# EAGLE design ChordControllerMain (EAGLE 5.10)

## Sheet 1 of 2
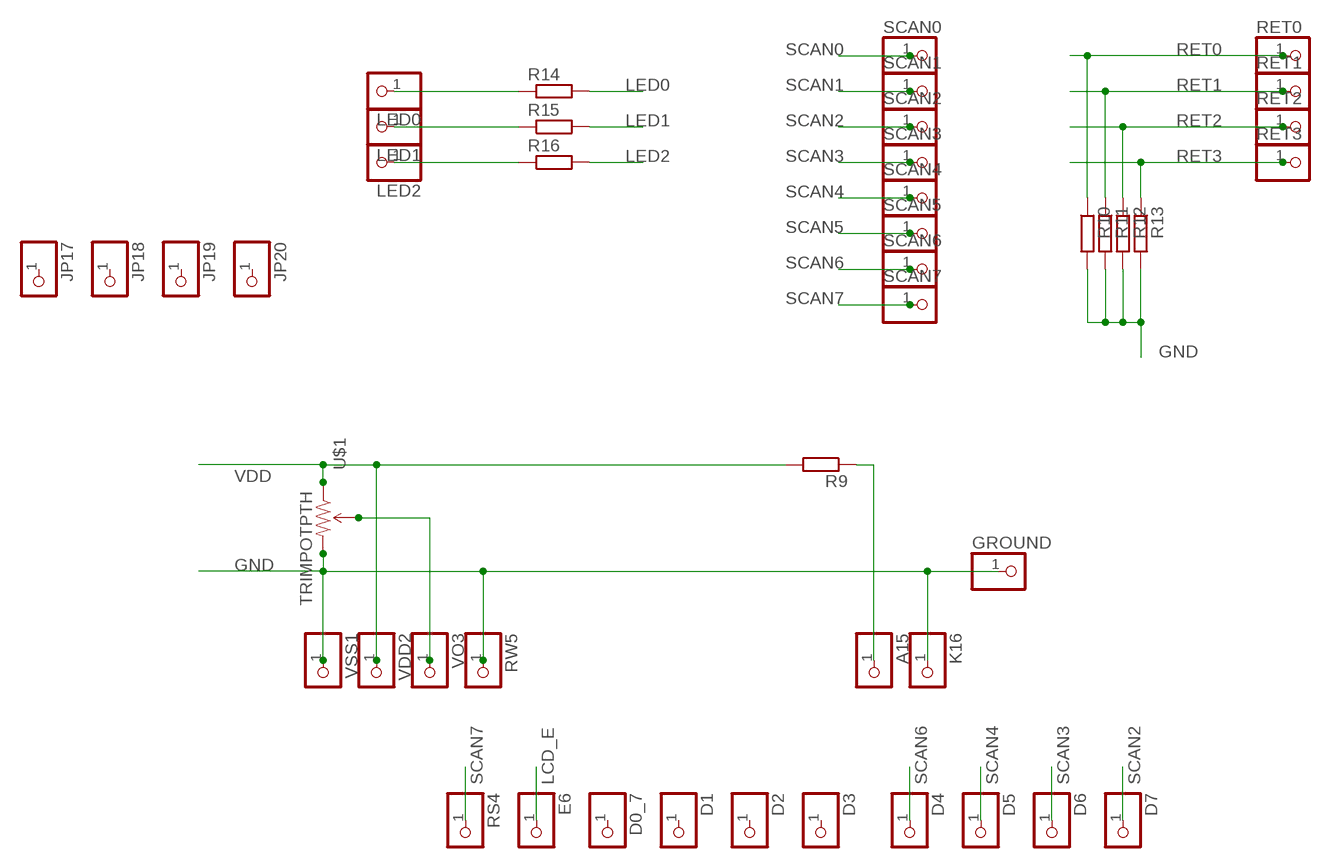
[diagram p0: schematic, sheet 1]

### Parts
A15  PINHD-1X1  [1X01]
D0_7  PINHD-1X1  [1X01]
D1  PINHD-1X1  [1X01]
D2  PINHD-1X1  [1X01]
D3  PINHD-1X1  [1X01]
D4  PINHD-1X1  [1X01]
D5  PINHD-1X1  [1X01]
D6  PINHD-1X1  [1X01]
D7  PINHD-1X1  [1X01]
E6  PINHD-1X1  [1X01]
GROUND  PINHD-1X1  [1X01]
JP17  PINHD-1X1  [1X01]
JP18  PINHD-1X1  [1X01]
JP19  PINHD-1X1  [1X01]
JP20  PINHD-1X1  [1X01]
K16  PINHD-1X1  [1X01]
LED0  PINHD-1X1  [1X01]
LED1  PINHD-1X1  [1X01]
LED2  PINHD-1X1  [1X01]
R9  R-EU_0204/7  [0204/7]
R10  R-EU_0204/7  [0204/7]
R11  R-EU_0204/7  [0204/7]
R12  R-EU_0204/7  [0204/7]
R13  R-EU_0204/7  [0204/7]
R14  R-EU_0204/7  [0204/7]
R15  R-EU_0204/7  [0204/7]
R16  R-EU_0204/7  [0204/7]
RET0  PINHD-1X1  [1X01]
RET1  PINHD-1X1  [1X01]
RET2  PINHD-1X1  [1X01]
RET3  PINHD-1X1  [1X01]
RS4  PINHD-1X1  [1X01]
RW5  PINHD-1X1  [1X01]
SCAN0  PINHD-1X1  [1X01]
SCAN1  PINHD-1X1  [1X01]
SCAN2  PINHD-1X1  [1X01]
SCAN3  PINHD-1X1  [1X01]
SCAN4  PINHD-1X1  [1X01]
SCAN5  PINHD-1X1  [1X01]
SCAN6  PINHD-1X1  [1X01]
SCAN7  PINHD-1X1  [1X01]
U$1  TRIMPOTPTH  [TRIM_POT_PTH]
VDD2  PINHD-1X1  [1X01]
VO3  PINHD-1X1  [1X01]
VSS1  PINHD-1X1  [1X01]

### Nets
GND: GROUND.1 K16.1 R10.2 R11.2 R12.2 R13.2 RW5.1 U$1.3(CW) VSS1.1 ; also sheet 2
LCD_E: E6.1 ; also sheet 2
LED0: R14.2 ; also sheet 2
LED1: R15.2 ; also sheet 2
LED2: R16.2 ; also sheet 2
N$20: LED0.1 R14.1
N$22: LED1.1 R15.1
N$23: U$1.2(WIPER) VO3.1
N$24: LED2.1 R16.1
N$31: A15.1 R9.1
RET0: R10.1 RET0.1 ; also sheet 2
RET1: R11.1 RET1.1 ; also sheet 2
RET2: R12.1 RET2.1 ; also sheet 2
RET3: R13.1 RET3.1 ; also sheet 2
SCAN0: SCAN0.1 ; also sheet 2
SCAN1: SCAN1.1 ; also sheet 2
SCAN2: D7.1 SCAN2.1 ; also sheet 2
SCAN3: D6.1 SCAN3.1 ; also sheet 2
SCAN4: D5.1 SCAN4.1 ; also sheet 2
SCAN5: SCAN5.1 ; also sheet 2
SCAN6: D4.1 SCAN6.1 ; also sheet 2
SCAN7: RS4.1 SCAN7.1 ; also sheet 2
VDD: R9.2 U$1.1(CCW) VDD2.1 ; also sheet 2
Unconnected: D0_7.1 D1.1 D2.1 D3.1 JP17.1 JP18.1 JP19.1 JP20.1

## Sheet 2 of 2
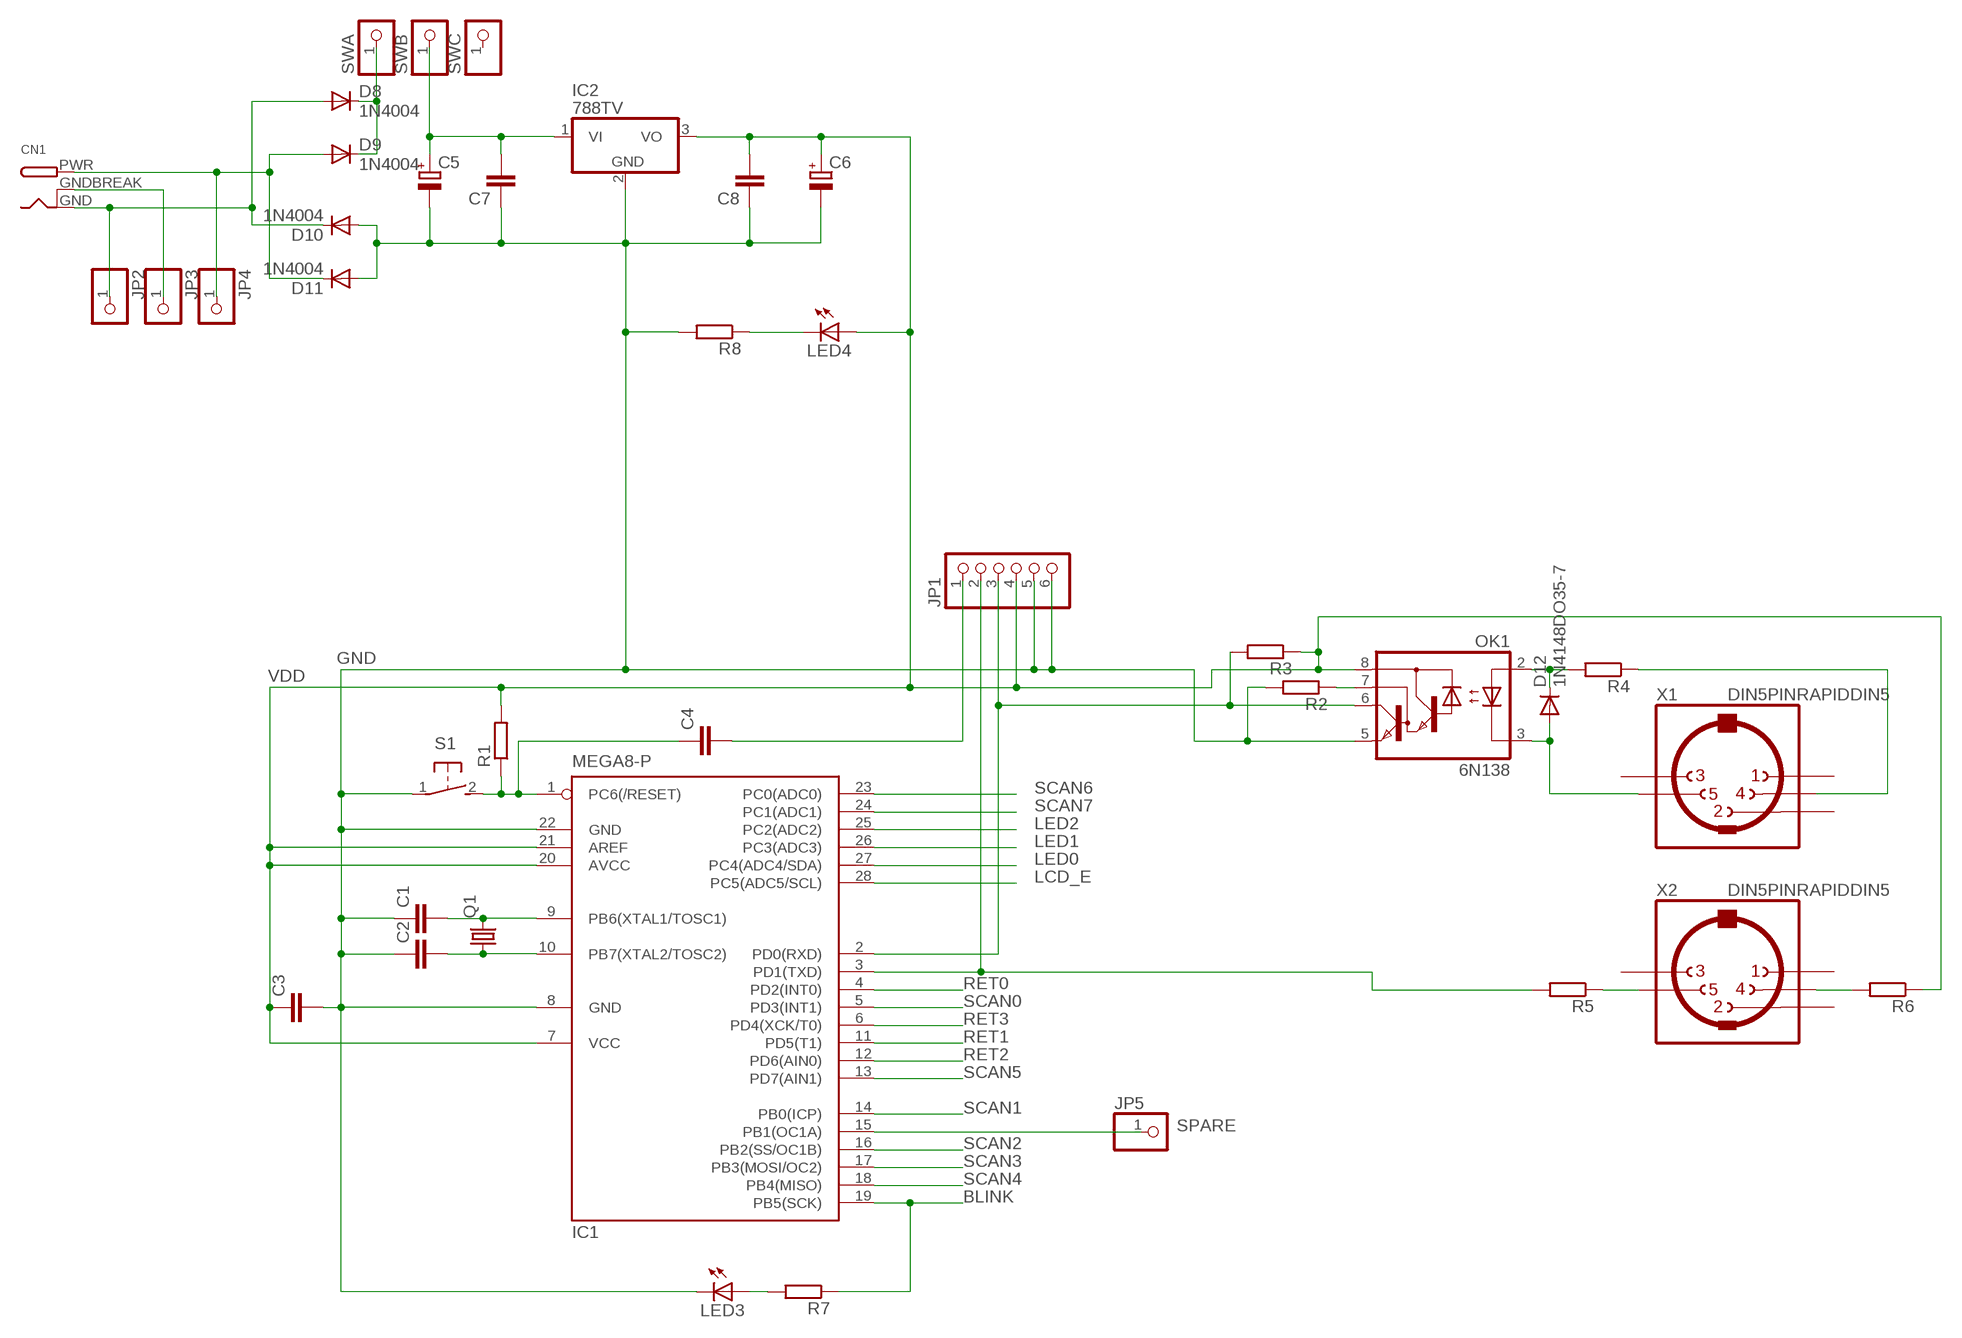
[diagram p1: schematic, sheet 2]

### Parts
C1  C-EU025-025X050  [C025-025X050]
C2  C-EU025-025X050  [C025-025X050]
C3  C-EU025-025X050  [C025-025X050]
C4  C-EU025-025X050  [C025-025X050]
C5  CPOL-EUE2.5-6  [E2,5-6]
C6  CPOL-EUE2.5-6  [E2,5-6]
C7  C-EU025-025X050  [C025-025X050]
C8  C-EU025-025X050  [C025-025X050]
CN1  DCBARRELPTH  [DCJACK_2MM_PTH]
D8  1N4004  [DO41-10]
D9  1N4004  [DO41-10]
D10  1N4004  [DO41-10]
D11  1N4004  [DO41-10]
D12  1N4148DO35-7  [DO35-7]
IC1  MEGA8-P  [DIL28-3]
IC2  788TV  [TO220V]
JP1  PINHD-1X6  [1X06]
JP2  HEADER-1X1  [1X01_OVAL]
JP3  HEADER-1X1  [1X01_OVAL]
JP4  HEADER-1X1  [1X01_OVAL]
JP5  HEADER-1X1  [1X01_OVAL]
LED3  LED3MM  [LED3MM]
LED4  LED3MM  [LED3MM]
OK1  6N138  [DIL08]
Q1  CRYSTALHC49S  [HC49/S]
R1  R-EU_0204/7  [0204/7]
R2  R-EU_0204/7  [0204/7]
R3  R-EU_0204/7  [0204/7]
R4  R-EU_0204/7  [0204/7]
R5  R-EU_0204/7  [0204/7]
R6  R-EU_0204/7  [0204/7]
R7  R-EU_0204/7  [0204/7]
R8  R-EU_0204/7  [0204/7]
S1  31-XX  [B3F-31XX]
SWA  HEADER-1X1  [1X01_OVAL]
SWB  HEADER-1X1  [1X01_OVAL]
SWC  HEADER-1X1  [1X01_OVAL]
X1  DIN5PINRAPIDDIN5  [RAPIDDIN5]
X2  DIN5PINRAPIDDIN5  [RAPIDDIN5]

### Nets
BLINK: IC1.19(PB5(SCK)) R7.1
GND: C1.1 C2.1 C3.2 C5.- C6.- C7.1 C8.1 D10.A D11.A IC1.8(GND) IC1.22(GND) IC2.2(GND) JP1.5 JP1.6 LED3.K(C) OK1.5(GND) R2.2 R8.2 S1.1(P) ; also sheet 1
LCD_E: IC1.28(PC5(ADC5/SCL)) ; also sheet 1
LED0: IC1.27(PC4(ADC4/SDA)) ; also sheet 1
LED1: IC1.26(PC3(ADC3)) ; also sheet 1
LED2: IC1.25(PC2(ADC2)) ; also sheet 1
N$1: C1.2 IC1.9(PB6(XTAL1/TOSC1)) Q1.2
N$2: C2.2 IC1.10(PB7(XTAL2/TOSC2)) Q1.1
N$3: LED4.K(C) R8.1
N$4: D8.C D9.C SWA.1
N$5: C4.1 IC1.1(PC6(/RESET)) R1.1 S1.2(S)
N$6: C5.+ C7.2 IC2.1(VI) SWB.1
N$7: C4.2 JP1.1
N$9: IC1.3(PD1(TXD)) JP1.2 R5.2
N$10: IC1.2(PD0(RXD)) JP1.3 OK1.6(VO) R3.2
N$11: CN1.PWR D9.A D11.C JP4.1
N$12: CN1.GND D8.A D10.C JP2.1
N$13: CN1.GNDBREAK JP3.1
N$14: OK1.7(VB) R2.1
N$15: D12.C OK1.2(A) R4.2
N$16: D12.A OK1.3(C) X1.5
N$17: R4.1 X1.4
N$18: R5.1 X2.5
N$19: R6.2 X2.4
N$21: LED3.A R7.2
RET0: IC1.4(PD2(INT0)) ; also sheet 1
RET1: IC1.11(PD5(T1)) ; also sheet 1
RET2: IC1.12(PD6(AIN0)) ; also sheet 1
RET3: IC1.6(PD4(XCK/T0)) ; also sheet 1
SCAN0: IC1.5(PD3(INT1)) ; also sheet 1
SCAN1: IC1.14(PB0(ICP)) ; also sheet 1
SCAN2: IC1.16(PB2(SS/OC1B)) ; also sheet 1
SCAN3: IC1.17(PB3(MOSI/OC2)) ; also sheet 1
SCAN4: IC1.18(PB4(MISO)) ; also sheet 1
SCAN5: IC1.13(PD7(AIN1)) ; also sheet 1
SCAN6: IC1.23(PC0(ADC0)) ; also sheet 1
SCAN7: IC1.24(PC1(ADC1)) ; also sheet 1
SPARE: IC1.15(PB1(OC1A)) JP5.1
VDD: C3.1 C6.+ C8.2 IC1.7(VCC) IC1.20(AVCC) IC1.21(AREF) IC2.3(VO) JP1.4 LED4.A OK1.8(VCC) R1.2 R3.1 R6.1 ; also sheet 1
Unconnected: SWC.1 X1.1 X1.2 X1.3 X2.1 X2.2 X2.3

## Library data of the parts
A15 D0_7 D1-D7 E6 GROUND JP17-JP20 K16 LED0 LED1 LED2 RET0 RET1-RET3 RS4 RW5 SCAN0 SCAN1-SCAN7 VDD2 VO3 VSS1 = adafruit:PINHD-1X1: Pin header 1x1 for 0.1" spacing With round pins
C1-C4 C7 C8 = rcl:C-EU: CAPACITOR, European symbol
C5 C6 = rcl:CPOL-EU: POLARIZED CAPACITOR, European symbol
CN1 = adafruit:DCBARREL: 2.0mm DC Barrel Jack DCJACK_2MM_PTH - Through Hole Jack (4UConnector: 05537)
D8-D11 = diode:1N4004: DIODE general purpose rectifier, 1 A
D12 = diode:1N4148: DIODE high speed (Philips)
IC1 = atmel:MEGA8-P: MICROCONTROLLER 8 Kbytes FLASH, 1 kbytes SRAM, 512 bytes EEPROM, USART, 4-channel 10 bit ADC, 2-channel 8 bit ADC Pin compatible with Atmega48, ATMega88, ATMega168 Source: avr.lbr
IC2 = linear:78*: Positive VOLTAGE REGULATOR Source: http://cache.national.com/ds/LM/LM78L05.pdf http://www.fairchildsemi.com/ds/LM/LM7805.pdf
JP1 = pinhead:PINHD-1X6: PIN HEADER
JP2-JP5 SWA SWB SWC = microbuilder:HEADER-1X1: PIN HEADER
LED3 LED4 = adafruit:LED: LED OSRAM: - CHIPLED LG R971, LG N971, LY N971, LG Q971, LY Q971, LO R971, LY R971 LH N974, LH R974 LS Q976, LO Q976, LY Q976 LO Q996 - Hyper CHIPLED LW Q18S LB Q993, LB Q99A, LB R99A - SideLED LS A670, LO A670, LY A670, LG A670, LP A670 LB A673, LV A673, LT A673, LW A673 LH A674 LY A675 LS A676, LA A676, LO A676, LY A676, LW A676 LS A679, LY A679, LG A679 - Hyper Micro SIDELED® LS Y876, LA Y876, LO Y876, LY Y876 LT Y87S - SmartLED LW L88C, LW L88S LB L89C, LB L89S, LG L890 LS L89K, LO L89K, LY L89K LS L896, LA L896, LO L896, LY L896 - TOPLED LS T670, LO T670, LY T670, LG T670, LP T670 LSG T670, LSP T670, LSY T670, LOP T670, LYG T670 LG T671, LOG T671, LSG T671 LB T673, LV T673, LT T673, LW T673 LH T674 LS T676, LA T676, LO T676, LY T676, LB T676, LH T676, LSB T676, LW T676 LB T67C, LV T67C, LT T67C, LS T67K, LO T67K, LY T67K, LW E67C LS E67B, LA E67B, LO E67B, LY E67B, LB E67C, LV E67C, LT E67C LW T67C LS T679, LY T679, LG T679 LS T770, LO T770, LY T770, LG T770, LP T770 LB T773, LV T773, LT T773, LW T773 LH T774 LS E675, LA E675, LY E675, LS T675 LS T776, LA T776, LO T776, LY T776, LB T776 LHGB T686 LT T68C, LB T68C - Hyper Mini TOPLED® LB M676 - Mini TOPLED Santana® LG M470 LS M47K, LO M47K, LY M47K Source: http://www.osram.convergy.de/
OK1 = optocoupler:6N138: MOTOROLA OPTO COUPLER
Q1 = crystal:CRYSTAL: CRYSTAL
R1-R16 = rcl:R-EU_: RESISTOR, European symbol
S1 = switch-omron:31-XX: OMRON SWITCH
U$1 = SparkFun:TRIMPOT
X1 X2 = jasons_stuff:DIN5PIN: Female CONNECTOR 5 pins 90 deg. with shield, horizontal (DIN 41524)

## Board
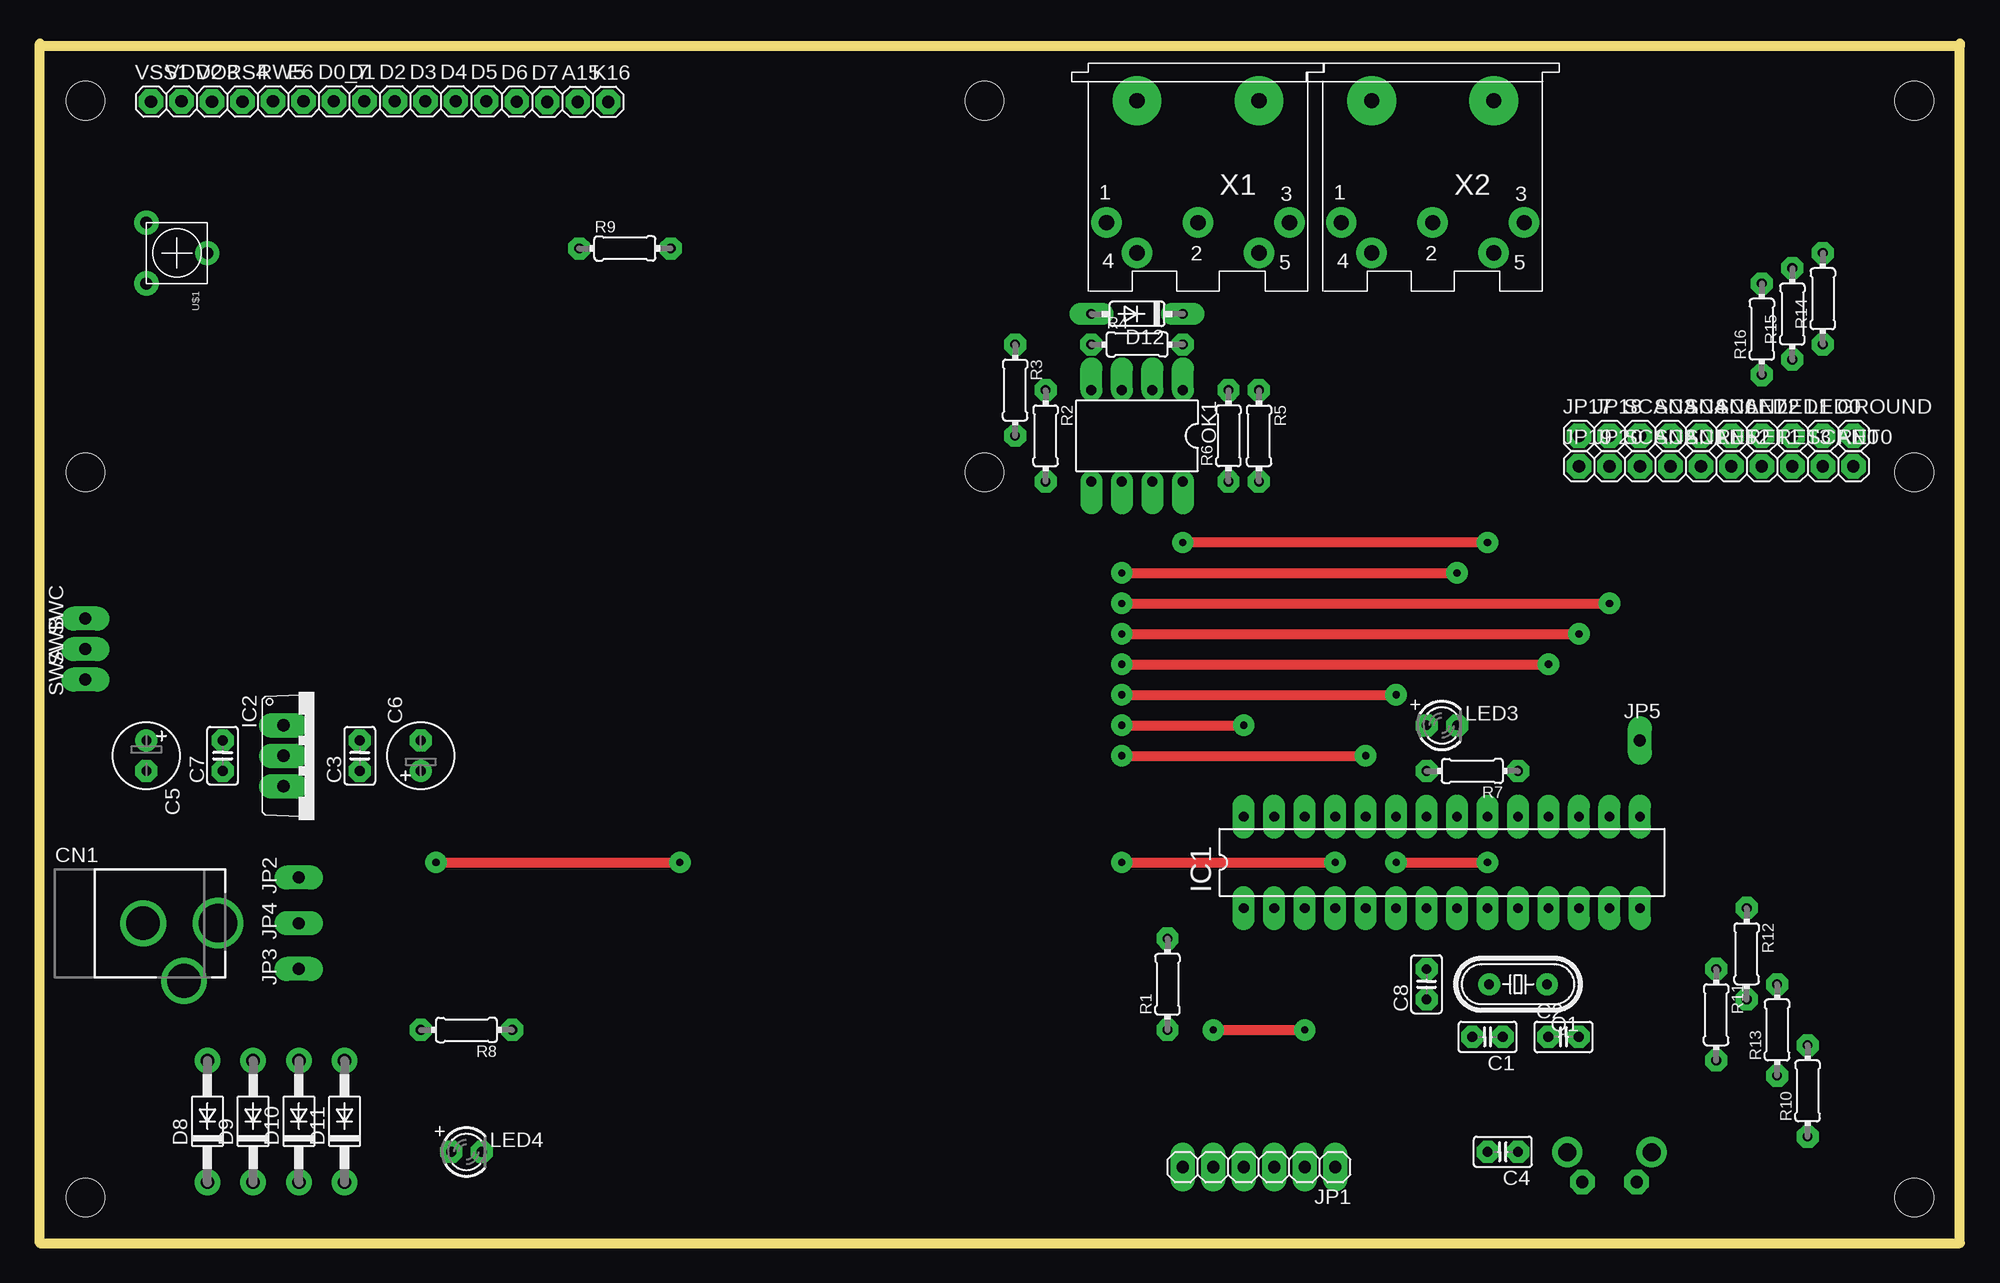
[diagram p2: board, top side]
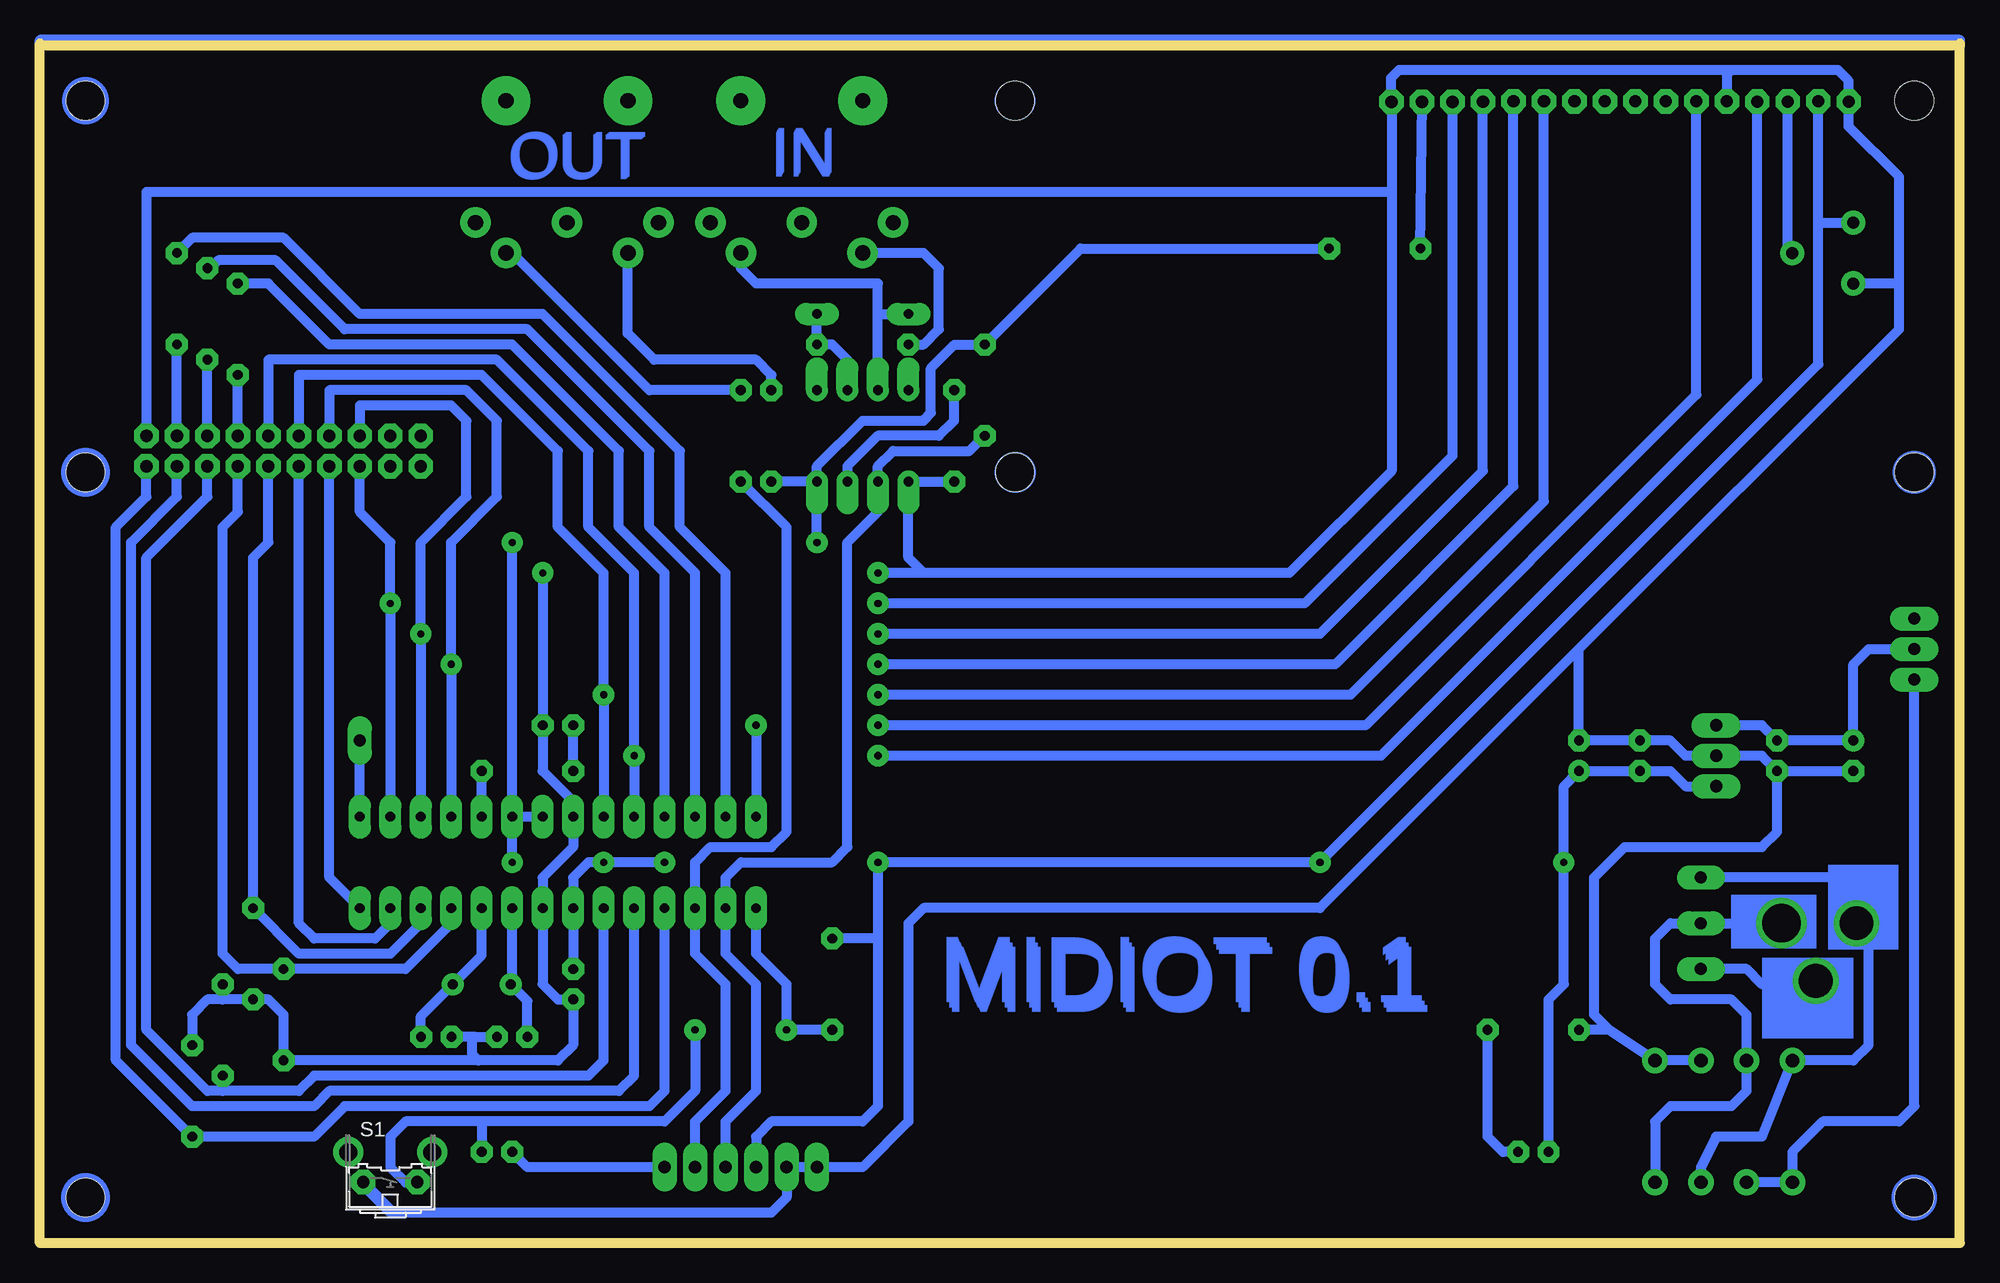
[diagram p3: board, bottom side, seen from below]

Size 160.02 x 100 mm. Coordinates in mm from the lower left corner, seen from the top.
Outline: 0,99.82 0,0 160.02,0 160.02,100
Outline: 0,99.82 0,100
Outline: 0,99.82 160.02,99.82
Copper layers (1*16): Top 0.035mm / dielectric 1.5mm / Bottom 0.035mm
Design rules "default *": minimum track width 10mil, minimum drill 24mil, track to track 8mil, track to pad 8mil, pad to pad 8mil, via to via 8mil, smd to smd 8mil, copper to edge 40mil, drill to drill 8mil, minimum pad ring 20mil, minimum via ring 8mil, stop-mask expansion 4mil, vias tented up to drill 0mil, thermal gap 10mil
Holes 3.2 mm at 156.21,95.25 3.81,95.25 156.21,3.81 3.81,3.81 3.81,64.26 78.74,95.25 78.74,64.26 156.21,64.26

### Footprints (pad centres in the part's own frame; a part is rotated, then mirrored left to right if it is on the bottom)
1X01 = drill 1.016 pad 1.93 octagon: 1 0,0
C025-025X050 = drill 0.813 octagon: 1 -1.27,0; 2 1.27,0
E2,5-6 = drill 0.813 pad 1.6 round: + -1.27,0 | drill 0.813 pad 1.6 octagon: - 1.27,0
DCJACK_2MM_PTH = drill 2.8 round: GND 0,7.35; GNDBREAK 4.8,10.75 | drill 3.2 round: PWR 0,13.6
DO41-10 = drill 1.118 round: A 5.08,0; C -5.08,0
DO35-7 = drill 0.813 long: A 3.81,0; C -3.81,0
DIL28-3 = drill 0.813 long: 1 -16.51,-3.81; 2 -13.97,-3.81; 3 -11.43,-3.81; 4 -8.89,-3.81; 5 -6.35,-3.81; 6 -3.81,-3.81; 7 -1.27,-3.81; 8 1.27,-3.81; 9 3.81,-3.81; 10 6.35,-3.81; 11 8.89,-3.81; 12 11.43,-3.81; 13 13.97,-3.81; 14 16.51,-3.81; 15 16.51,3.81; 16 13.97,3.81; 17 11.43,3.81; 18 8.89,3.81; 19 6.35,3.81; 20 3.81,3.81; 21 1.27,3.81; 22 -1.27,3.81; 23 -3.81,3.81; 24 -6.35,3.81; 25 -8.89,3.81; 26 -11.43,3.81; 27 -13.97,3.81; 28 -16.51,3.81
TO220V = drill 1.016 long: 1 -2.54,-2.54; 2 0,-2.54; 3 2.54,-2.54
1X06 = drill 1.016 long: 1 -6.35,0; 2 -3.81,0; 3 -1.27,0; 4 1.27,0; 5 3.81,0; 6 6.35,0
1X01_OVAL = drill 1 pad 1.676 long: 1 0,0
LED3MM = drill 0.813 pad 1.676 octagon: A -1.27,0; K 1.27,0
DIL08 = drill 0.813 offset: 1 -3.81,-3.81; 2 -1.27,-3.81; 3 1.27,-3.81; 4 3.81,-3.81; 5 3.81,3.81; 6 1.27,3.81; 7 -1.27,3.81; 8 -3.81,3.81
HC49/S = drill 0.813 round: 1 -2.413,0; 2 2.413,0
0204/7 = drill 0.813 octagon: 1 -3.81,0; 2 3.81,0
B3F-31XX = drill 1.016 octagon: 1 -2.261,-1.245; 2 2.261,-1.245 | drill 1.499 pad 2.159 round: 3 -3.505,1.245; 4 3.505,1.245
TRIM_POT_PTH = drill 1 pad 1.88 round: 1 -2.54,-2.54; 2 0,2.54; 3 2.54,-2.54
RAPIDDIN5 = drill 1.27 pad 2.54 round: 1 7.62,5.08; 2 0,5.08; 3 -7.62,5.08; 4 5.08,7.62; 5 -5.08,7.62 | drill 1.27 pad 4.064 round: NC -5.08,-5.08; NC@ 5.08,-5.08

### Placement (x,y rotation side)
A15  44.83,95.15 0 top
C1  120.65,17.2 180 top
C2  126.97,17.2 0 top
C3  26.67,40.64 90 top
C4  121.92,7.62 180 top
C5  8.89,40.64 270 top
C6  31.75,40.64 90 top
C7  15.24,40.64 90 top
C8  115.57,21.59 90 top
CN1  1.27,26.67 270 top
D0_7  24.51,95.2 0 top
D1  27.05,95.2 0 top
D2  29.59,95.2 0 top
D3  32.13,95.2 0 top
D4  34.67,95.2 0 top
D5  37.21,95.2 0 top
D6  39.75,95.17 0 top
D7  42.29,95.15 0 top
D8  13.97,10.16 90 top
D9  17.78,10.16 90 top
D10  21.59,10.16 90 top
D11  25.4,10.16 90 top
D12  91.44,77.47 180 top
E6  21.97,95.2 0 top
GROUND  151.13,67.31 0 top
IC1  116.84,31.75 0 top
IC2  22.86,40.64 270 top
JP1  101.6,6.35 180 top
JP2  21.59,30.48 90 top
JP3  21.59,22.86 90 top
JP4  21.59,26.67 90 top
JP5  133.35,41.91 0 top
JP17  128.27,67.31 0 top
JP18  130.81,67.31 0 top
JP19  128.27,64.77 0 top
JP20  130.81,64.77 0 top
K16  47.37,95.15 0 top
LED0  148.59,67.31 0 top
LED1  146.05,67.31 0 top
LED2  143.51,67.31 0 top
LED3  116.84,43.18 0 top
LED4  35.56,7.62 0 top
OK1  91.44,67.31 180 top
Q1  123.19,21.59 180 top
R1  93.98,21.59 90 top
R2  83.82,67.31 270 top
R3  81.28,71.12 270 top
R4  91.44,74.93 0 top
R5  101.6,67.31 270 top
R6  99.06,67.31 90 top
R7  119.38,39.37 180 top
R8  35.56,17.78 180 top
R9  48.77,82.93 0 top
R10  147.32,12.7 90 top
R11  139.7,19.05 270 top
R12  142.24,24.13 270 top
R13  144.78,17.78 90 top
R14  148.59,78.74 90 top
R15  146.05,77.47 90 top
R16  143.51,76.2 90 top
RET0  151.13,64.77 0 top
RET1  143.51,64.77 0 top
RET2  140.97,64.77 0 top
RET3  146.05,64.77 0 top
RS4  16.89,95.17 0 top
RW5  19.43,95.2 0 top
S1  130.81,6.35 0 bottom
SCAN0  148.59,64.77 0 top
SCAN1  135.89,64.77 0 top
SCAN2  133.35,64.77 0 top
SCAN3  133.35,67.31 0 top
SCAN4  135.89,67.31 0 top
SCAN5  138.43,64.77 0 top
SCAN6  138.43,67.31 0 top
SCAN7  140.97,67.31 0 top
SWA  3.81,46.99 90 top
SWB  3.81,49.53 90 top
SWC  3.81,52.07 90 top
U$1  11.43,82.55 270 top
VDD2  11.81,95.2 0 top
VO3  14.35,95.17 0 top
VSS1  9.27,95.17 0 top
X1  96.52,90.17 180 top
X2  116.08,90.17 180 top

### Tracks (layer width: path | path; a pad name or v marks a point on that pad's centre or on a via)
BLINK
  Bottom 0.813: IC1.19 R7.1
GND  (via drill 0.6 pad 1.78)
  Top 0.813: v90.17,55.88 v118.11,55.88
  Bottom 0.813: R2.2 OK1.5 87.63,57.15 86.36,55.88 | D10.A D11.A 29.21,17.78 | C7.1 C5.- | C7.1 16.51,40.64 IC2.2 22.86,40.64 24.13,41.91 C3.2 C6.- 31.75,49.53 | C7.1 15.24,34.29 16.51,33.02 27.94,33.02 30.48,30.48 30.48,19.05 29.21,17.78 | 47.37,87.63 K16.1 47.42,95.2 47.42,97.13 46.76,97.79 19.05,97.79 | 47.37,87.63 47.37,64.39 55.88,55.88 86.36,55.88 | GROUND.1 151.13,87.63 47.37,87.63 | v118.11,55.88 LED3.K 118.11,39.37 115.57,36.83 IC1.22 115.57,33.02 118.11,30.48 IC1.8 118.11,21.59 116.84,20.32 C8.1 115.57,16.51 116.84,15.24 123.47,15.24 | 86.36,55.88 v90.17,55.88 | 5.08,80.01 5.08,88.9 9.27,93.09 VSS1.1 9.27,96.9 10.16,97.79 19.05,97.79 | 5.08,80.01 U$1.3 | RW5.1 19.43,97.41 19.05,97.79 | 130.5,2.54 99.06,2.54 97.79,3.81 JP1.5 JP1.6 91.44,6.35 87.63,10.16 87.63,26.67 86.36,27.94 53.34,27.94 31.75,49.53 | 130.5,2.54 S1.1 133.07,4.8 130.81,2.54 130.5,2.54 | 123.7,17.2 C1.1 | 123.7,17.2 C2.1 | 123.47,15.24 123.98,15.75 123.98,16.92 123.7,17.2 | 29.21,17.78 R8.2 | 5.08,80.01 5.08,76.2 31.75,49.53 | 123.47,15.24 R11.2 139.7,19.05 140.97,20.32 R12.2 144.78,20.32 | 144.78,20.32 146.05,20.32 147.32,19.05 R10.2 | 144.78,20.32 R13.2
LCD_E  (via drill 0.6 pad 1.78)
  Top 0.813: v90.17,43.18 v100.33,43.18
  Bottom 0.813: v90.17,43.18 49.53,43.18 21.97,70.74 E6.1 | v100.33,43.18 IC1.28
LED0
  Bottom 0.813: IC1.27 102.87,55.88 106.68,59.69 106.68,66.04 118.11,77.47 133.35,77.47 139.7,83.82 147.32,83.82 R14.2
LED1
  Bottom 0.813: IC1.26 105.41,55.88 109.22,59.69 109.22,66.04 119.38,76.2 134.62,76.2 140.36,81.94 145.14,81.94 145.8,81.28 R15.2
LED2
  Bottom 0.813: IC1.25 107.95,55.88 111.76,59.69 111.76,66.04 120.65,74.93 135.89,74.93 140.97,80.01 R16.2
N$1
  Bottom 0.813: IC1.9 120.65,21.72 Q1.2 119.38,20.19 C1.2
N$2
  Bottom 0.813: IC1.10 123.19,24 Q1.1 128.27,18.92 C2.2
N$3
  Bottom 0.813: LED4.K 38.1,7.62 39.37,8.89 R8.1
N$4
  Bottom 0.813: D9.C D8.C 13.97,7.62 11.43,10.16 5.08,10.16 3.81,11.43 SWA.1
N$5  (via drill 0.6 pad 1.78)
  Top 0.813: v97.79,17.78 v105.41,17.78
  Bottom 0.813: v105.41,17.78 105.41,12.7 107.95,10.16 123.19,10.16 | IC1.1 100.33,24.13 97.79,21.59 v97.79,17.78 R1.1 | 123.19,10.16 129.54,10.16 130.81,8.89 130.81,6.35 129.54,5.08 128.57,5.08 S1.2 | 123.19,10.16 C4.1
N$6
  Bottom 0.813: IC2.1 16.51,43.18 C7.2 C5.+ 8.89,48.26 7.62,49.53 SWB.1
N$7
  Bottom 0.813: JP1.1 119.38,6.35 C4.2
N$8
  Bottom 0.813: 160.02,0 160.02,100.33 0,100.33 0,0 160.02,0
N$9
  Bottom 0.813: R5.2 97.79,59.69 97.79,34.29 99.06,33.02 104.14,33.02 105.41,31.75 IC1.3 105.41,24.13 102.87,21.59 102.87,12.7 105.41,10.16 JP1.2
N$10
  Bottom 0.813: R3.2 82.55,66.04 88.9,66.04 90.17,64.77 OK1.6 90.17,60.96 92.71,58.42 92.71,33.02 93.98,31.75 101.6,31.75 102.87,30.48 IC1.2 102.87,24.13 100.33,21.59 100.33,12.7 102.87,10.16 JP1.3
N$11
  Bottom 0.813: D9.A 17.78,16.51 | CN1.PWR JP4.1 24.13,26.67 25.4,25.4 25.4,21.59 24.13,20.32 19.05,20.32 17.78,19.05 D9.A | D9.A 17.78,12.7 19.05,11.43 24.13,11.43 25.4,10.16 D11.C
N$12
  Bottom 0.813: D10.C 21.59,6.35 20.32,8.89 16.51,8.89 D8.A 8.89,15.24 7.62,16.51 7.62,25.67 CN1.GND | CN1.GND 8.89,26.67 | JP2.1 8.89,30.48 8.89,26.94 CN1.GND
N$13
  Bottom 0.813: JP3.1 17.78,22.86 16.51,21.59 12.3,21.59 CN1.GNDBREAK
N$14
  Bottom 0.813: R2.1 83.82,68.58 85.09,67.31 90.17,67.31 92.71,64.77 OK1.7
N$15
  Bottom 0.813: OK1.2 92.71,73.66 93.98,74.93 R4.2 D12.C
N$16
  Bottom 0.813: X1.5 101.6,81.28 100.33,80.01 90.17,80.01 90.17,77.47 | OK1.3 90.17,77.47 | 90.17,77.47 D12.A
N$17
  Bottom 0.813: X1.4 86.36,82.55 85.09,81.28 85.09,76.2 86.36,74.93 R4.1
N$18
  Bottom 0.813: R5.1 109.22,71.12 120.65,82.55 X2.5
N$19
  Bottom 0.813: R6.2 99.06,72.39 100.33,73.66 108.81,73.66 111.02,75.87 111.02,81.81 111.76,82.55 X2.4
N$20
  Bottom 0.813: LED0.1 R14.1
N$21
  Bottom 0.813: R7.2 LED3.A
N$22
  Bottom 0.813: LED1.1 R15.1
N$23
  Bottom 0.813: VO3.1 14.35,82.93 U$1.2
N$24
  Bottom 0.813: LED2.1 R16.1
N$31
  Bottom 0.813: R9.1 A15.1
RET0
  Bottom 0.813: IC1.4 107.95,12.7 109.22,11.43 134.62,11.43 137.16,8.89 R10.1 153.67,15.24 153.67,59.69 151.13,62.23 RET0.1
RET1
  Bottom 0.813: IC1.11 125.73,26.67 129.54,22.86 R11.1 143.51,22.86 144.78,24.13 144.78,59.69 143.51,60.96 RET1.1
RET2
  Bottom 0.813: IC1.12 128.27,26.67 130.81,24.13 138.43,24.13 R12.1 142.24,57.15 140.97,58.42 RET2.1
RET3
  Bottom 0.813: IC1.6 113.03,15.24 114.3,13.97 137.16,13.97 138.43,12.7 144.78,12.7 | RET3.1 146.05,62.23 151.13,57.15 151.13,17.78 146.05,12.7 144.78,12.7 | 144.78,12.7 R13.1
SCAN0
  Bottom 0.813: IC1.5 110.49,13.97 111.76,12.7 135.89,12.7 137.16,11.43 147.32,11.43 152.4,16.51 152.4,58.42 148.59,62.23 SCAN0.1
SCAN1
  Bottom 0.813: SCAN1.1 135.89,30.48 IC1.14
SCAN2  (via drill 0.6 pad 1.78)
  Top 0.813: v90.17,53.34 v130.81,53.34
  Bottom 0.813: SCAN2.1 133.35,60.96 130.81,58.42 v130.81,53.34 IC1.16 | v90.17,53.34 54.61,53.34 42.29,65.66 D7.1
SCAN3  (via drill 0.6 pad 1.78)
  Top 0.813: v90.17,50.8 v128.27,50.8
  Bottom 0.813: SCAN3.1 133.35,69.85 125.73,69.85 124.46,68.58 124.46,62.23 128.27,58.42 v128.27,50.8 IC1.17 | v90.17,50.8 53.34,50.8 39.75,64.39 D6.1
SCAN4  (via drill 0.6 pad 1.78)
  Top 0.813: v90.17,48.26 v125.73,48.26
  Bottom 0.813: SCAN4.1 135.89,71.12 124.46,71.12 121.92,68.58 121.92,62.23 125.73,58.42 v125.73,48.26 IC1.18 | v90.17,48.26 52.07,48.26 37.21,63.12 D5.1
SCAN5
  Bottom 0.813: SCAN5.1 138.43,26.67 137.16,25.4 132.08,25.4 130.81,26.67 IC1.13
SCAN6  (via drill 0.6 pad 1.78)
  Top 0.813: v90.17,45.72 v113.03,45.72
  Bottom 0.813: SCAN6.1 138.43,72.39 123.19,72.39 116.84,66.04 116.84,59.69 113.03,55.88 v113.03,45.72 IC1.23 | v90.17,45.72 50.8,45.72 34.67,61.85 D4.1
SCAN7  (via drill 0.6 pad 1.78)
  Top 0.813: v90.17,40.64 v110.49,40.64
  Bottom 0.813: SCAN7.1 140.97,73.66 121.92,73.66 114.3,66.04 114.3,59.69 110.49,55.88 v110.49,40.64 IC1.24 | v90.17,40.64 48.26,40.64 16.89,72.01 RS4.1
SPARE
  Bottom 0.813: IC1.15 JP5.1
VDD  (via drill 0.6 pad 1.78)
  Top 0.813: v113.03,31.75 v120.65,31.75 | v120.65,58.42 v95.25,58.42 | v90.17,31.75 v107.95,31.75 | v33.02,31.75 v53.34,31.75
  Bottom 0.813: OK1.8 R6.1 | IC2.3 22.86,38.1 24.13,39.37 C3.1 C6.+ 33.02,38.1 v33.02,31.75 33.02,21.59 34.29,20.32 LED4.A | OK1.8 95.25,64.77 91.44,68.58 86.36,68.58 86.36,68.63 85.75,69.24 85.75,72.95 83.8,74.91 81.31,74.91 R3.1 73.28,82.93 R9.2 | v120.65,31.75 IC1.20 | C8.2 IC1.7 115.57,30.48 114.3,31.75 v113.03,31.75 v107.95,31.75 | IC1.20 IC1.21 | IC1.20 v120.65,58.42 | v95.25,58.42 OK1.8 | 90.17,25.4 90.17,11.43 91.44,10.16 99.06,10.16 100.33,8.89 JP1.4 | 90.17,25.4 v90.17,31.75 v53.34,31.75 11.81,73.28 11.81,85.09 | 90.17,25.4 R1.2 | 11.81,85.09 VDD2.1 | 11.81,85.09 U$1.1
(copper drawn outside any net)
  shapes: Bottom area x3, Bottom circle x8

### Text on the board
Bottom: IN | IN | IN | OUT | OUT | OUT | MIDIOT 0.1 | MIDIOT 0.1 | MIDIOT 0.1